# EAGLE design esp8266-addon-card-v1a-open (EAGLE 8.4.1)
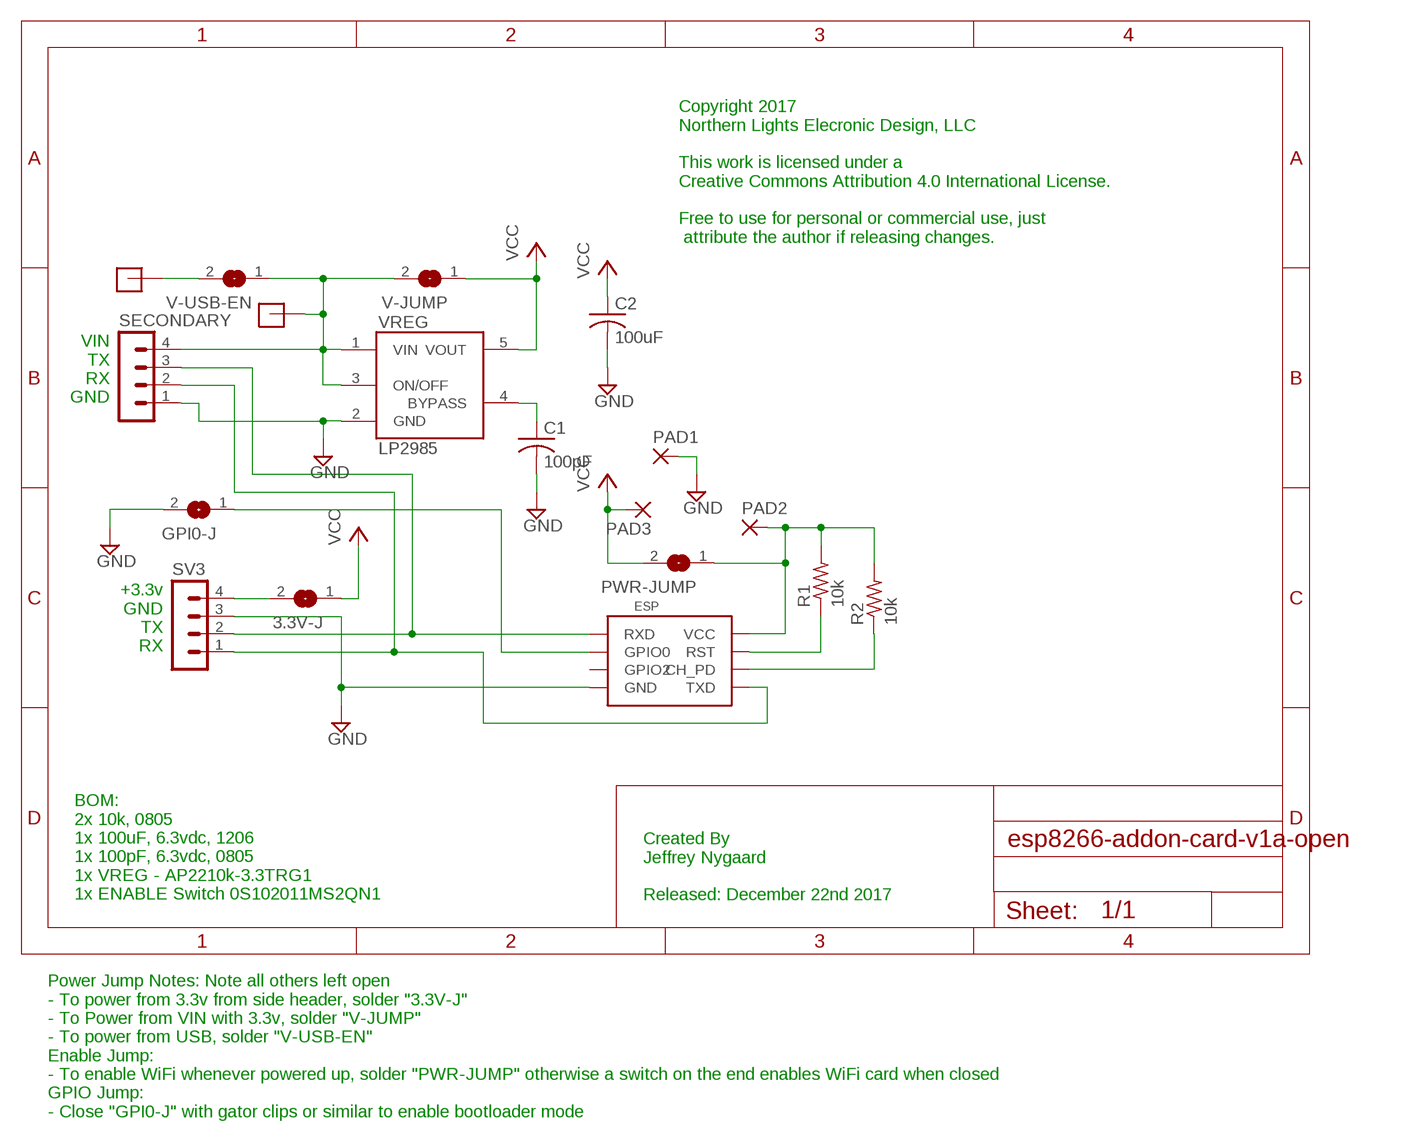
[diagram p0: schematic, sheet 1]

## Parts
3.3V-J  SJ  [SJ]
C1  100pF  C-USC0805  [C0805]
C2  100uF  C-USC1206  [C1206]
ESP  ESP8266  [ESP8266-2]
GPI0-J  SJW  [SJW]
PAD1  SMD2  [SMD1,27-2,54]
PAD2  SMD2  [SMD1,27-2,54]
PAD3  SMD2  [SMD1,27-2,54]
PWR-JUMP  SJ  [SJ]
R1  10k  R-US_M0805  [M0805]
R2  10k  R-US_M0805  [M0805]
SECONDARY  MA04-1  [MA04-1]
SV3  MA04-1  [MA04-1]
V-JUMP  SJ  [SJ]
V-USB  JUMPER  [JUMPER]
V-USB-EN  SJ  [SJ]
VIN  JUMPER  [JUMPER]
VREG  LP2985AIM5-3.3  [SOT25]

## Nets
BYPASS: C1.1 VREG.4(BYPASS)
GND: C1.2 C2.2 ESP.GND GPI0-J.2 PAD1.1(P) SECONDARY.1 SV3.3 VREG.2(GND)
N$1: ESP.TXD SECONDARY.2 SV3.1
N$2: ESP.RST R1.1
N$3: ESP.CH_PD R2.1
N$4: ESP.VCC PAD2.1(P) PWR-JUMP.1 R1.2 R2.2
N$8: ESP.GPIO0 GPI0-J.1
N$9: V-USB-EN.2 V-USB.2(J1)
N$10: ESP.RXD SECONDARY.3 SV3.2
N$11: SECONDARY.4 V-JUMP.2 V-USB-EN.1 VIN.2(J1) VREG.1(VIN) VREG.3(ON/OFF)
N$12: 3.3V-J.2 SV3.4
VCC: 3.3V-J.1 C2.1 PAD3.1(P) PWR-JUMP.2 V-JUMP.1 VREG.5(VOUT)
Unconnected: ESP.GPIO2

## Notes on the sheet
- Copyright 2017
  Northern Lights Elecronic Design, LLC
  
  This work is licensed under a 
  Creative Commons Attribution 4.0 International License.
  
  Free to use for personal or commercial use, just
   attribute the author if releasing changes.
- VIN
  TX
  RX
  GND
- +3.3v
  GND
  TX
  RX
- Created By
  Jeffrey Nygaard
  
  Released: December 22nd 2017
- BOM:
  2x 10k, 0805
  1x 100uF, 6.3vdc, 1206
  1x 100pF, 6.3vdc, 0805
  1x VREG - AP2210k-3.3TRG1
  1x ENABLE Switch 0S102011MS2QN1
- Power Jump Notes: Note all others left open 
  - To power from 3.3v from side header, solder "3.3V-J" 
  - To Power from VIN with 3.3v, solder "V-JUMP" 
  - To power from USB, solder "V-USB-EN" 
  Enable Jump: 
  - To enable WiFi whenever powered up, solder "PWR-JUMP" otherwise a switch on the end enables WiFi card when closed 
  GPIO Jump: 
  - Close "GPI0-J" with gator clips or similar to enable bootloader mode

## Library data of the parts
3.3V-J GPI0-J PWR-JUMP V-JUMP V-USB-EN = jumper:SJ: SMD solder JUMPER
C1 C2 = rcl:C-US: CAPACITOR, American symbol
ESP = ChromationSystems-2:ESP8266
PAD1-PAD3 = wirepad:SMD2: SMD PAD
R1 R2 = rcl:R-US_: RESISTOR, American symbol
SECONDARY SV3 = ChromationSystems-2:MA04-1: PIN HEADER; OC_FARNELL: unknown; OC_NEWARK: unknown
V-USB VIN = ChromationSystems-1:JUMPER
VREG = LP2985:LP2985: LP2985-N Micropower 150 mA Low-Noise Ultra Low-Dropout Regulator

## Board
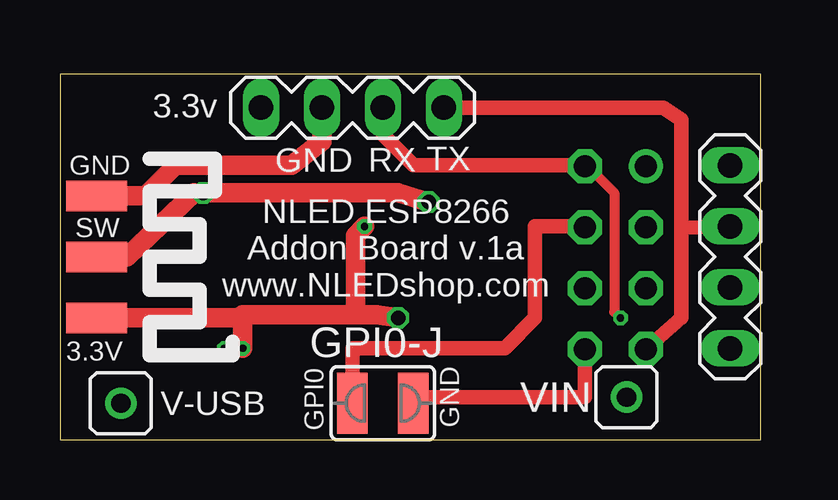
[diagram p1: board, top side]
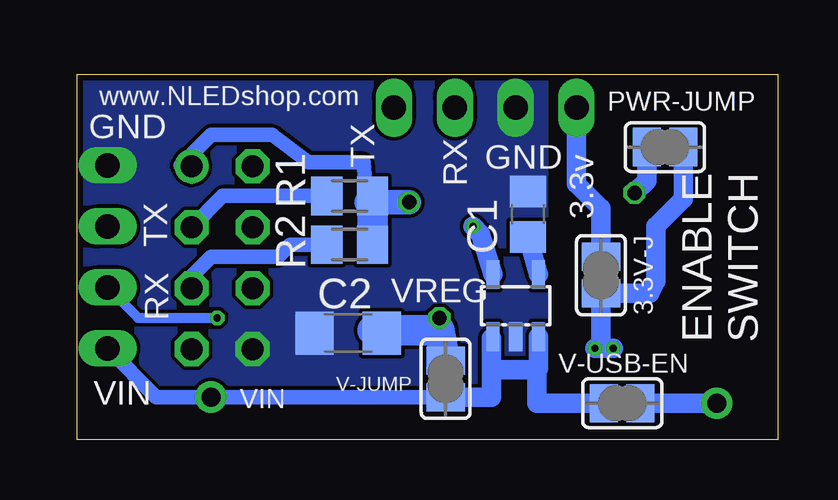
[diagram p2: board, bottom side, seen from below]

Size 29.21 x 15.24 mm. Coordinates in mm from the lower left corner, seen from the top.
Outline: 0,0 29.21,0 29.21,15.24 0,15.24 0,0
Copper layers (1*16): Top 0.035mm / dielectric 1.5mm / Bottom 0.035mm
Design rules "SeeedStudio_2layer_DRU_no_angle_20140221 *": minimum track width 16mil, minimum drill 12mil, track to track 6mil, track to pad 6mil, pad to pad 6mil, via to via 6mil, smd to smd 0mil, copper to edge 10mil, drill to drill 10mil, minimum pad ring 10mil, minimum via ring 6mil, stop-mask expansion 2mil, vias tented up to drill 100mil, thermal gap 10mil
bRestrict: 1 lines

### Footprints (pad centres in the part's own frame; a part is rotated, then mirrored left to right if it is on the bottom)
SJ = smd 1.168 x 1.6: 1 -0.762,0; 2 0.762,0
C0805 = smd 1.3 x 1.5: 1 -0.95,0; 2 0.95,0
C1206 = smd 1.6 x 1.8: 1 -1.4,0; 2 1.4,0
ESP8266-2 = drill 0.914 octagon: CH_PD 10.97,-1.3; GND 8.43,-3.84; GPIO0 8.43,1.24; GPIO2 8.43,-1.3; RST 10.97,1.24; RXD 8.43,3.78; TXD 10.97,-3.84 | drill 0.914: VCC 10.97,3.78
SJW = smd 1.27 x 2.54: 1 -1.27,0; 2 1.27,0
SMD1,27-2,54 = smd 1.27 x 2.54: 1 0,0
M0805 = smd 1.3 x 1.6: 1 -0.95,0; 2 0.95,0
MA04-1 = drill 1.016 long: 1 -3.81,0; 2 -1.27,0; 3 1.27,0; 4 3.81,0
JUMPER = drill 0.8: 2 0,0
SOT25 = smd 0.55 x 1.2: 1 -0.95,-1.3; 2 0,-1.3; 3 0.95,-1.3; 4 0.95,1.3; 5 -0.95,1.3

### Placement (x,y rotation side)
3.3V-J  7.37,6.86 90 bottom
C1  10.41,9.4 90 bottom
C2  17.91,4.45 180 bottom
ESP  13.46,7.62 0 top
GPI0-J  13.46,1.52 0 top
PAD1  1.52,10.16 270 top
PAD2  1.52,7.62 270 top
PAD3  1.52,5.08 270 top
PWR-JUMP  4.7,12.19 0 bottom
R1  17.84,10.16 0 bottom
R2  17.84,8.13 0 bottom
SECONDARY  27.94,7.62 270 top
SV3  12.19,13.84 180 top
V-JUMP  13.84,2.54 270 bottom
V-USB  2.54,1.52 0 top
V-USB-EN  6.48,1.52 0 bottom
VIN  23.62,1.78 0 top
VREG  10.92,5.59 0 bottom

### Tracks (layer width: path | path; a pad name or v marks a point on that pad's centre or on a via)
BYPASS
  Bottom 0.813: VREG.4 10.48,8.64 C1.1
GND
  Top 0.61: GPI0-J.2 14.86,1.52 15.11,1.78 21.89,1.78 ESP.GND
  Top 0.813: PAD1.1 3.56,10.16 4.83,11.43 9.65,11.43 10.92,12.45 SV3.3
  pour Bottom (no thermals): 0,15.11 0,0 29.21,0 29.21,15.11
N$1
  Top 0.406: 25.02,13.84 25.15,13.84
  Top 0.61: SV3.1 25.02,13.84 | ESP.TXD 24.46,3.81 25.91,5.08 25.91,8.76 | 25.91,8.76 25.98,8.84 SECONDARY.2 | 25.15,13.84 25.91,13.34 25.91,8.76
N$2
  Bottom 0.61: R1.1 23.13,10.16 ESP.RST
N$3
  Bottom 0.61: ESP.CH_PD 24.43,6.81 23.62,7.62 20.83,7.62 20.32,8.13 R2.1
N$4  (via drill 0.6)
  Top 0.61: v5.97,10.29 5.59,10.29
  Top 0.813: PAD2.1 2.79,7.62 5.59,10.29 | v5.97,10.29 14.1,10.29 v15.37,9.91
  Bottom 0.61: 24.43,10.97 ESP.VCC 24.46,11.43 24.89,11.43 23.62,12.7 21.08,12.7 19.56,11.56 17.27,11.56 17.14,10.03 16,10.04 R1.2 17.15,9.91
  Bottom 0.813: PWR-JUMP.1 5.46,10.79 v5.97,10.29
  Bottom 1.016: v15.37,9.91 17.15,9.91
  Bottom 1.27: R1.2 R2.2
N$8
  Top 0.61: GPI0-J.1 12.19,3.81 18.54,3.81 19.81,5.08 19.81,8.89 21.86,8.89 ESP.GPIO0
N$9
  Bottom 0.813: V-USB-EN.2 V-USB.2
N$10  (via drill 0.3)
  Top 0.406: ESP.RXD 22,11.4 23.11,10.29 23.11,5.33 v23.37,5.08
  Top 0.61: 13.46,13.97 SV3.2 13.46,12.7 14.73,11.43 21.86,11.43 ESP.RXD
  Bottom 0.406: SECONDARY.3 26.67,5.08 v23.37,5.08
N$11
  Bottom 0.406: 11.94,4.22 VREG.1
  Bottom 0.61: V-JUMP.2 VIN.2 25.91,1.78 SECONDARY.4
  Bottom 0.813: VREG.3 9.97,2.98 10.03,2.92 | 10.03,2.92 11.94,2.92 | 11.94,2.92 11.94,4.22 | V-JUMP.2 11.94,1.78 11.94,2.92 | 10.03,2.92 10.03,1.52 V-USB-EN.1
N$12
  Bottom 0.813: SV3.4 8.38,10.67 7.37,9.65 3.3V-J.2
VCC  (via drill 0.3, 0.6)
  Top 0.61: v14.1,5.08 12.32,5.21 | 7.49,5.08 7.62,5.21
  Top 0.813: PAD3.1 7.49,5.08 | 12.32,5.21 7.62,5.21 v7.62,3.81 | 12.32,5.21 13.21,5.21 v14.1,5.08 | 12.32,5.21 12.32,8.51 v12.7,8.89
  Bottom 0.152: 16.89,4.57 C2.1
  Bottom 0.61: 14.1,4.57 v14.1,5.08
  Bottom 0.813: PWR-JUMP.2 3.94,10.03 5.08,8.89 5.08,6.6 5.33,6.1 3.3V-J.1 7.37,3.81 v7.62,3.81 v6.86,3.81 | VREG.5 12.38,8.57 v12.7,8.89
  Bottom 1.27: V-JUMP.1 14.1,4.57 16.89,4.57

### Text on the board
tNames: 3.3v | GND | GND | RX | TX | SW | NLED ESP8266 / Addon Board v.1a / www.NLEDshop.com | 3.3V | GND | GPI0
bNames: www.NLEDshop.com | RX | TX | GND | GND | TX | 3.3v | ENABLE / SWITCH | RX | VIN | VIN